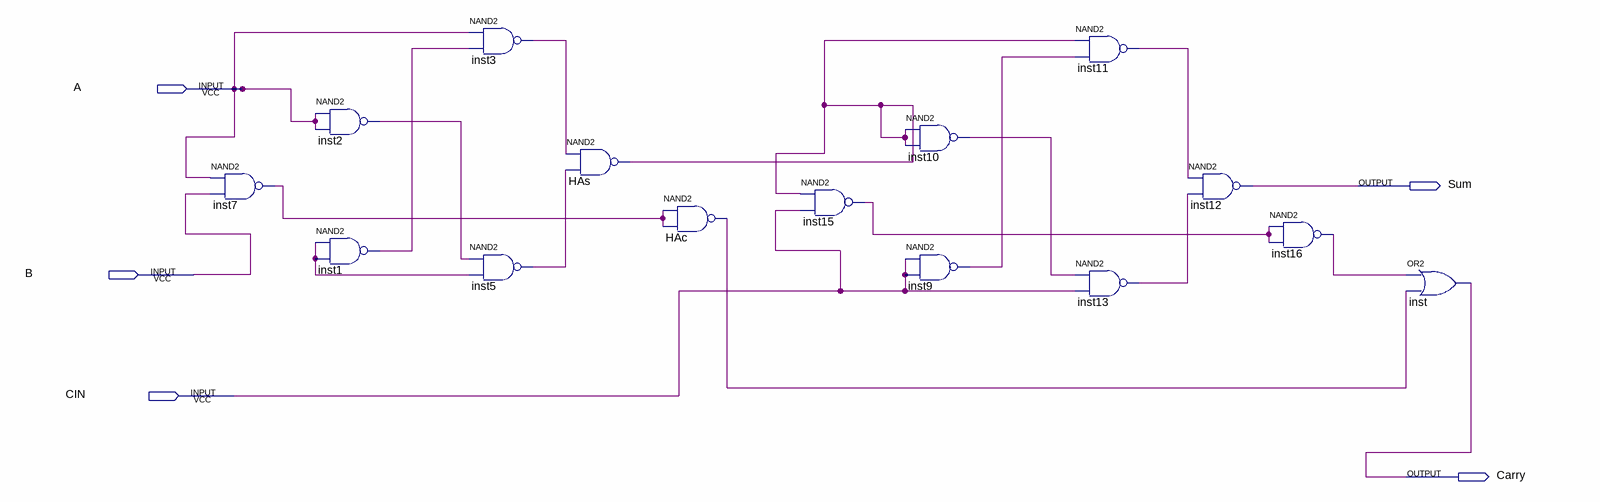
[diagram p0: schematic sheet]
// Quartus schematic fulladder.bdf as structural Verilog: 15 symbols, 5 pins
module fulladder (
  input  A,
  input  B,
  input  CIN,
  output Sum,
  output Carry
);

  wire HAc_out, HAs_out, inst1_out, inst2_out, inst3_out, inst5_out, inst7_out, inst9_out, inst10_out,
       inst11_out, inst13_out, inst15_out, inst16_out, undriven;

  nand inst7 (inst7_out, A, B);
  nand inst2 (inst2_out, A, A);
  nand inst1 (inst1_out, undriven, undriven);
  nand inst3 (inst3_out, A, inst1_out);
  nand inst5 (inst5_out, inst2_out, undriven);
  nand HAs (HAs_out, inst3_out, inst5_out);
  nand HAc (HAc_out, inst7_out, inst7_out);
  nand inst15 (inst15_out, HAs_out, CIN);
  nand inst10 (inst10_out, HAs_out, HAs_out);
  nand inst9 (inst9_out, CIN, CIN);
  nand inst11 (inst11_out, HAs_out, inst9_out);
  nand inst13 (inst13_out, inst10_out, CIN);
  nand inst12 (Sum, inst11_out, inst13_out);
  nand inst16 (inst16_out, inst15_out, inst15_out);
  or inst (Carry, inst16_out, HAc_out);
endmodule
